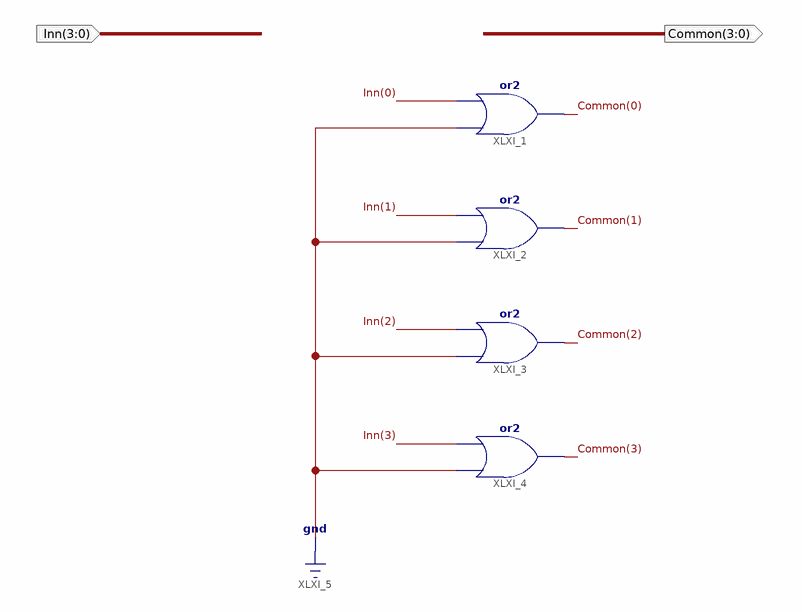
[diagram p0: schematic sheet 1]
// Xilinx ISE schematic Common.sch (spartan6) as structural Verilog: 4 symbols, 2 ports
module Common (
  input  [3:0] Inn,
  output [3:0] Common
);

  or XLXI_1 (Common[0], 1'b0, Inn[0]);
  or XLXI_2 (Common[1], 1'b0, Inn[1]);
  or XLXI_3 (Common[2], 1'b0, Inn[2]);
  or XLXI_4 (Common[3], 1'b0, Inn[3]);
endmodule
